# EAGLE schematic practice (EAGLE 9.6.2)
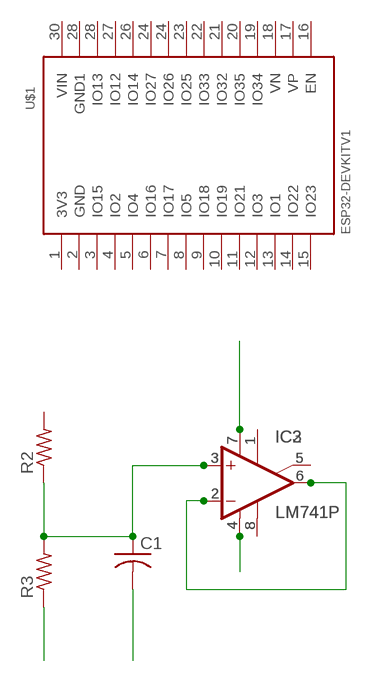
[diagram p0: schematic, sheet 1]

## Parts
C1  C-US025-040X050  [C025-040X050]
IC2  LM741P  [DIL08]
IC3  LM741P  [DIL08]
R2  R-US_0207/10  [0207/10]
R3  R-US_0207/10  [0207/10]
U$1  ESP32DEVKITV1  [ESP32-DEVKITV1]

## Nets
N$1: IC2.5(ON2) IC3.5(ON2)
N$2: IC2.1(ON1) IC3.1(ON1)
N$3: IC2.2(-IN) IC2.6(OUT) IC3.2(-IN) IC3.6(OUT)
N$6: IC2.8(OPT) IC3.8(OPT)
N$7: IC2.7(V+) IC3.7(V+)
N$8: IC2.4(V-) IC3.4(V-)
N$9: C1.1 IC2.3(+IN) IC3.3(+IN) R2.1 R3.2
N$10: R3.1
N$11: C1.2
Unconnected: R2.2 U$1.1(3V3) U$1.2(GND) U$1.3(IO15) U$1.4(IO2) U$1.5(IO4) U$1.6(IO16) U$1.7(IO17) U$1.8(IO5) U$1.9(IO18) U$1.10(IO19) U$1.11(IO21) U$1.12(IO3) U$1.13(IO1) U$1.14(IO22) U$1.15(IO23) U$1.16(EN) U$1.17(VP) U$1.18(VN) U$1.19(IO34) U$1.20(IO35) U$1.21(IO32) U$1.22(IO33) U$1.23(IO25) U$1.24(IO26) U$1.24(IO27) U$1.26(IO14) U$1.27(IO12) U$1.28(GND1) U$1.28(IO13) U$1.30(VIN)

## Library data of the parts
C1 = rcl:C-US: CAPACITOR, American symbol; SPICEPREFIX: C
IC2 IC3 = linear:*741: OP AMP
R2 R3 = rcl:R-US_: RESISTOR, American symbol; SPICEPREFIX: R
U$1 = ESP32-DEVKITV1:ESP32DEVKITV1